# Altium schematic sheet TLM_002_CONNECT.SchDoc: =DocumentName
size A4; CompanyName: Scopa Industries LLC; Engineer: Nazar Lysenko / Andrii Antonenko; Organization: Scopa Industries LLC; Address1: Kyiv; Address2: Ukraine; Address3: https://www.scopa.industries/; Address4: oleksyi.y@scopa.industries; SheetNumber: 11; SheetTotal: 11
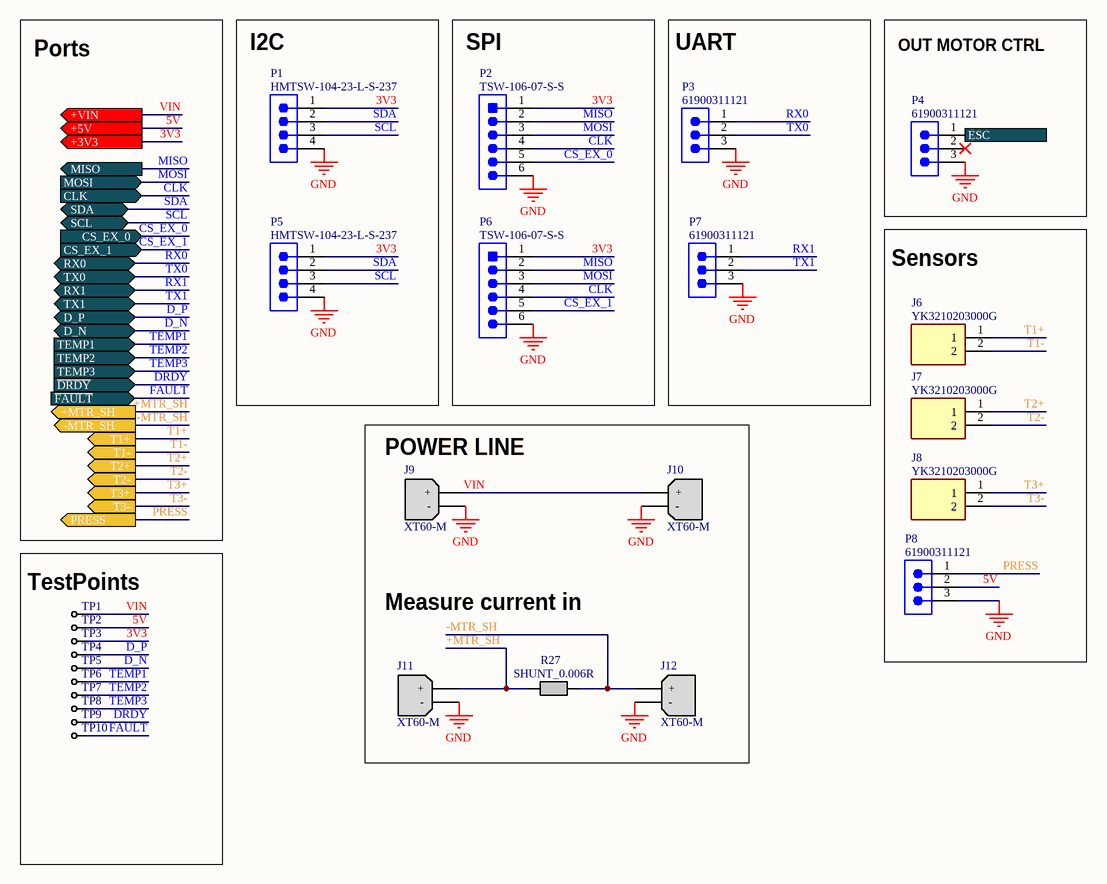
[diagram p0: TLM_002_CONNECT.SchDoc]

## Parts
J6  YK3210203000G  [YK3210203000G]
J7  YK3210203000G  [YK3210203000G]
J8  YK3210203000G  [YK3210203000G]
J9  XT60-M  [AMASS_XT60-M]
J10  XT60-M  [AMASS_XT60-M]
J11  XT60-M  [AMASS_XT60-M]
J12  XT60-M  [AMASS_XT60-M]
P1  HMTSW-104-23-L-S-237  [SMTC-HMTSW-104-23-X-S-237]
P2  TSW-106-07-S-S  [SMTC-TSW-106-07-S-S_V]
P3  61900311121  [61900311121]
P4  61900311121  [61900311121]
P5  HMTSW-104-23-L-S-237  [SMTC-HMTSW-104-23-X-S-237]
P6  TSW-106-07-S-S  [SMTC-TSW-106-07-S-S_V]
P7  61900311121  [61900311121]
P8  61900311121  [61900311121]
R27  SHUNT_0.006R  [SHUNT]
TP1  TestPoint  [TestPoint]  (value not drawn)
TP2  TestPoint  [TestPoint]  (value not drawn)
TP3  TestPoint  [TestPoint]  (value not drawn)
TP4  TestPoint  [TestPoint]  (value not drawn)
TP5  TestPoint  [TestPoint]  (value not drawn)
TP6  TestPoint  [TestPoint]  (value not drawn)
TP7  TestPoint  [TestPoint]  (value not drawn)
TP8  TestPoint  [TestPoint]  (value not drawn)
TP9  TestPoint  [TestPoint]  (value not drawn)
TP10  TestPoint  [TestPoint]  (value not drawn)

## Ports
+3V3 (out, see TLM_002_MBR[4A], TLM_002_SRC[4C]), +5V (out, see TLM_002_MBR[4A], TLM_002_SRC[4A]), +MTR_SH (out, see TLM_002_MBR[4C]), +VIN (out, see TLM_002_MBR[4A]), -MTR_SH (out, see TLM_002_MBR[4C]), CLK (in, see TLM_002_MBR[4B], TLM_002_ESP32S3[2B], TLM_002_MAX6675[2B], TLM_002_MAX31856[2B], TLM_002_SD[3B]), CS_EX_0 (in, see TLM_002_MBR[4B], TLM_002_ESP32S3[3B]), CS_EX_1 (in, see TLM_002_MBR[4B], TLM_002_ESP32S3[3B]), D_N (bidir, see TLM_002_MBR[4C], TLM_002_ESP32S3[3A], TLM_002_SRC[2C]), D_P (bidir, see TLM_002_MBR[4C], TLM_002_ESP32S3[3A], TLM_002_SRC[2C]), ESC (in, see TLM_002_MBR[4C], TLM_002_ESP32S3[3B]), MISO (out, see TLM_002_MBR[4B], TLM_002_ESP32S3[3B], TLM_002_MAX6675[2B], TLM_002_MAX31856[2B], TLM_002_SD[3B]), MOSI (in, see TLM_002_MBR[4B], TLM_002_ESP32S3[2B], TLM_002_MAX31856[2B], TLM_002_SD[3B]), PRESS (out, see TLM_002_MBR[4B], TLM_002_MCP3021[1B]), RX0 (bidir, see TLM_002_MBR[4C], TLM_002_ESP32S3[4A]), RX1 (bidir, see TLM_002_MBR[4C], TLM_002_ESP32S3[2B]), SCL (bidir, see TLM_002_MBR[4C], TLM_002_DS3231SN_RTC[2B], TLM_002_ESP32S3[2B], TLM_002_INA228[2B], TLM_002_MCP3021[4B]), SDA (bidir, see TLM_002_MBR[4B], TLM_002_DS3231SN_RTC[2B], TLM_002_ESP32S3[2B], TLM_002_INA228[2B], TLM_002_MCP3021[3B]), T1+ (out, see TLM_002_MBR[4B]), T1- (out, see TLM_002_MBR[4B]), T2+ (out, see TLM_002_MBR[4B]), T2- (out, see TLM_002_MBR[4B]), T3+ (out, see TLM_002_MBR[4B]), T3- (out, see TLM_002_MBR[4B]), TEMP1 (in, see TLM_002_MBR[4C], TLM_002_ESP32S3[2B]), TEMP2 (in, see TLM_002_MBR[4D], TLM_002_ESP32S3[2B]), TEMP3 (in, see TLM_002_MBR[4D], TLM_002_ESP32S3[2B]), TX0 (bidir, see TLM_002_MBR[4C], TLM_002_ESP32S3[4B]), TX1 (bidir, see TLM_002_MBR[4C], TLM_002_ESP32S3[2B]), ~{DRDY} (in, see TLM_002_MBR[4C], TLM_002_MAX31856[2C]), ~{FAULT} (in, see TLM_002_MBR[4C], TLM_002_MAX31856[2B])

## Nets
GND: J9.2(-) J10.2(-) J11.2(-) J12.2(-) P1.4 P2.6 P3.3 P4.3 P5.4 P6.6 P7.3 P8.3
3V3: P1.1 P2.1 P5.1 P6.1 TP3.1 ; port +3V3
5V: P8.2 TP2.1 ; port +5V
+MTR_SH: J11.1(+) R27.1 ; port +MTR_SH
-MTR_SH: J12.1(+) R27.2 ; port -MTR_SH
CLK: P2.4 P6.4 ; port CLK
CS_EX_0: P2.5 ; port CS_EX_0
CS_EX_1: P6.5 ; port CS_EX_1
~{DRDY}: TP9.1 ; port ~{DRDY}
D_N: TP5.1 ; port D_N
D_P: TP4.1 ; port D_P
ESC: P4.1 ; port ESC
~{FAULT}: TP10.1 ; port ~{FAULT}
MISO: P2.2 P6.2 ; port MISO
MOSI: P2.3 P6.3 ; port MOSI
PRESS: P8.1 ; port PRESS
RX0: P3.1 ; port RX0
RX1: P7.1 ; port RX1
SCL: P1.3 P5.3 ; port SCL
SDA: P1.2 P5.2 ; port SDA
T1+: J6.1 ; port T1+
T1-: J6.2 ; port T1-
T2+: J7.1 ; port T2+
T2-: J7.2 ; port T2-
T3+: J8.1 ; port T3+
T3-: J8.2 ; port T3-
TEMP1: TP6.1 ; port TEMP1
TEMP2: TP7.1 ; port TEMP2
TEMP3: TP8.1 ; port TEMP3
TX0: P3.2 ; port TX0
TX1: P7.2 ; port TX1
VIN: J9.1(+) J10.1(+) TP1.1 ; port +VIN

Not connected (* = marked no-connect by the designer): P4 2*

## Notes on the sheet
- I2C
- SPI
- UART
- Ports
- OUT MOTOR CTRL (ESC)
- Sensors
- POWER LINE
- TestPoints
- Measure current in motor
- Title
- Size:
- Date:
- A4
- Author:
- Time:
- Sheet
- Revision:
- of
- File:

## Library data of the parts
J6-J8 = YK3210203000G: Connector; Manufacturer_Name: Amphenol; Datasheet Link: https://eu.mouser.com/datasheet/2/18/7Pva_Bm2hlSl-1379478.pdf; Height: 15.9mm; Manufacturer_Part_Number: YK3210203000G; Mouser Part Number: 649-YK32102030J0G; Mouser Price/Stock: https://www.mouser.co.uk/ProductDetail/Amphenol-Anytek/YK3210203000G?qs=Mv7BduZupUi0q03DSkdXZw%3D%3D
J9-J12 = XT60-M: Plug; DC supply; XT60; male; PIN: 2; for cable; soldered; 30A; 500V; MF: AMASS; SnapEDA_Link: https://www.snapeda.com/parts/XT60-M/AMASS/view-part/?ref=snap; Package: Package; MP: XT60-M; Check_prices: https://www.snapeda.com/parts/XT60-M/AMASS/view-part/?ref=eda
P1 P5 = CMP-1024-00020-1: Modified .025" SQ Post Header, Through-hole, Vertical, -55 to 125 degC, 2.54 mm Pitch, 4-Pin, Male, RoHS; Manufacturer: Samtec; Pitch: 2.54 mm; ComponentLink3URL: http://www.samtec.com/documents/webfiles/cpdf/HMTSW-XXX-XX-X-X-XXXX-XX-XX-MKT1.pdf; PartNumber: HMTSW-104-23-L-S-237; Temperature Range: -55 to 125 degC; ComponentLink1Description: Manufacturer URL; Orientation: Vertical; ComponentLink3Description: Package Specification; ComponentLink2URL: http://www.samtec.com/documents/webfiles/pdf/HMTSW.PDF; DatasheetVersion: F-214; PackageDescription: Assembly .025 [.64] SQ. Post Hi-Temp Terminal Strip; ComponentLink1URL: http://www.samtec.com; PackageReference: HMTSW-104-23-X-S-237; RoHS: True; Mounting Technology: Through-hole; ComponentLink2Description: Datasheet; PackageVersion: AL, 3/1987
P2 P6 = CMP-1681-00007-2: Male Header, Pitch 2.54 mm, 1 x 6 Position, Height 8.38 mm, Tail Length 2.54 mm, -55 to 125 degC, RoHS, Bulk; Manufacturer: Samtec; Rows: 1; Contact Finish: Gold; Lead Pitch: 0.1 inch; Package Quantity: 1; Mounting Technology: Through Hole; ComponentLink1Description: Manufacturer URL; Contact Plating: Gold; DatasheetVersion: 12/2015; ComponentLink3Description: Package Specification; PackageDescription: Male Header, Pitch 2.54 mm, 1 x 6 Position, Height 8.38 mm, Tail Length 2.54 mm; Height: 8.38 mm; ComponentLink2Description: Datasheet; RoHSCompliant: true; Colour: Black; Packaging: Bulk; Min Operating Temperature: -55 degC; ComponentLink2URL: http://suddendocs.samtec.com/catalog_english/tsw_th.pdf; Mount: Through Hole; PackageReference: TSW-102-07-S-S; Pins: 6; Max Operating Temperature: 125 degC; ComponentLink3URL: http://suddendocs.samtec.com/prints/tsw-xxx-xx-x-x-xx-xxx-footprint.pdf; Length: 15.24 mm; Contact Material: Bronze; ComponentLink1URL: http://www.samtec.com/
P3 P4 P7 P8 = CMP-1502-00585-2: NexarPartId: 18818222; Current Rating: 3A; Voltage Rating: 250V; Number of Positions: 3; Insulation Resistance: 1GΩ; Gender: Male; Pitch: 2.54mm; Connector Type: Male Pin; Contact Resistance: 20mΩ; Termination: Through Hole; Width: 7.66mm; Contact Plating: Tin; Orientation: Vertical; Mount: Through Hole; Contact Gender: Male; Max Operating Temperature: 105°C; Length: 7.62mm; Number of Rows: 1; Height: 12.5mm; Lead Pitch: 2.54mm; Housing Material: Nylon; Color: Beige; Contact Material: Copper; Fastening Type: Friction; Min Operating Temperature: -40°C; Number of Contacts: 3; Number of Pins: 3; Flammability Rating: UL94 V-0; Contact Mating Length: 7.493mm; RoHS: Compliant; REACH SVHC: Unknown; Packaging: Bulk; Operating Supply Voltage: 250V